# Altium project UU003_UUViewer.PrjPcb
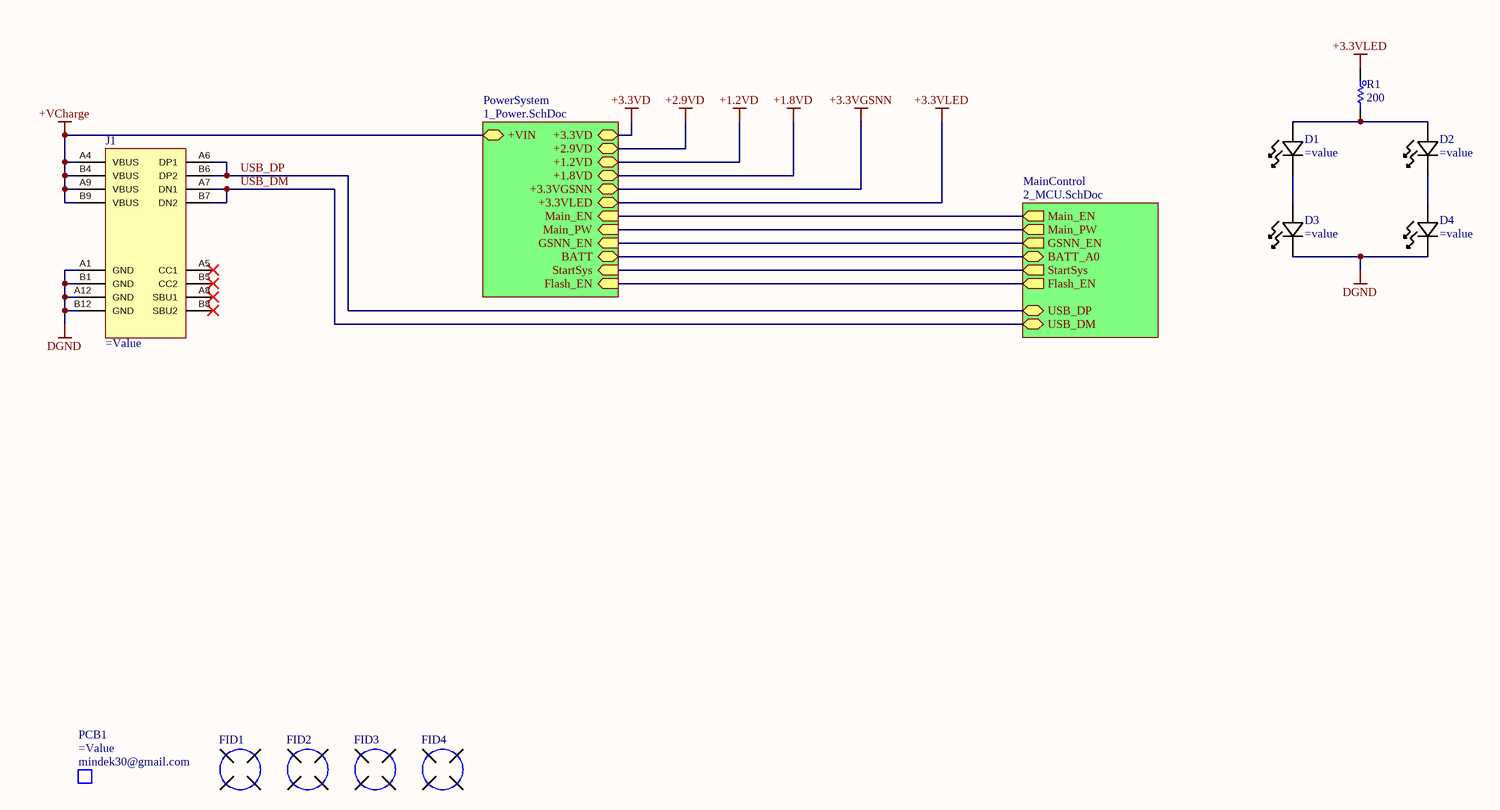
[diagram p0: 0_Overview.SchDoc]
PCB_Name: UU_MonitorMeter; PCB_PN: UM001; PCB_Rev: A; PCBA_PN: UM001; PCBA_Rev: A
3 sheets, 130 parts. Net scope: hierarchical (ports join the sheet entries above them; power ports are global).
Board file: UU001_UUViewer.PcbDoc
Sheets:
  0_Overview.SchDoc
    MainControl = 2_MCU.SchDoc
    PowerSystem = 1_Power.SchDoc

## Sheet 0_Overview.SchDoc: Overview
size A3; DocumentNumber: 1; SheetNumber: 1; SheetTotal: 6; PageSetup: Record=PageOptions|CenterHorizontal=True|CenterVertical=True|PrintScale=1.01|XCorrection=1.00|YCorrection=1.00|PrintKind=0|BorderSize=5000000|LeftOffset=0|BottomOffset=0|Orientation=2|PaperLength=1000|PaperWidth=1000|Scale=100|PaperSource=7|PrintQuality=-4|MediaType=1|DitherType=10|PaperKind=A3|PrintScaleMode=1

### Parts
D1  (no value)  [LED_0VS75000_WRE]
D2  (no value)  [LED_0VS75000_WRE]
D3  (no value)  [LED_0VS75000_WRE]
D4  (no value)  [LED_0VS75000_WRE]
FID1  FIDUCIAL  [FID]  (value not drawn)  (no BOM)
FID2  FIDUCIAL  [FID]  (value not drawn)  (no BOM)
FID3  FIDUCIAL  [FID]  (value not drawn)  (no BOM)
FID4  FIDUCIAL  [FID]  (value not drawn)  (no BOM)
J1  (no value)  [2137160001_MOL_2137160001(Primary)]
PCB1  Manufacturer: mindek30@gmail.com  (mechanical)
R1  200  [R_2512]

### Sub-sheets
MainControl = 2_MCU.SchDoc: BATT_A0 (bidir), GSNN_EN (out), USB_DP (bidir), USB_DM (bidir), Main_PW (out), Main_EN (out), StartSys (out), Flash_EN (out)
PowerSystem = 1_Power.SchDoc: +3.3VD (bidir), BATT (bidir), +VIN (bidir), +3.3VGSNN (bidir), +1.8VD (bidir), +2.9VD (bidir), GSNN_EN (in), +1.2VD (bidir), Main_PW (in), Main_EN (in), StartSys (in), Flash_EN (in), +3.3VLED (bidir)

### Nets
+3.3VLED: R1.1 ; sheet PowerSystem/+3.3VLED
+VCharge: J1.A4(VBUS) J1.A9(VBUS) J1.B4(VBUS) J1.B9(VBUS) ; sheet PowerSystem/+VIN
DGND: D3.2 D4.2 J1.A1(GND) J1.A12(GND) J1.B1(GND) J1.B12(GND)
LTE_GPSEN: sheet MainControl/GSNN_EN, sheet PowerSystem/GSNN_EN
Main_EN: sheet MainControl/Main_EN, sheet PowerSystem/Main_EN
Main_PW: sheet MainControl/Main_PW, sheet PowerSystem/Main_PW
RTC: sheet MainControl/StartSys, sheet PowerSystem/StartSys
USB_DM: J1.A7(DN1) J1.B7(DN2) ; sheet MainControl/USB_DM
USB_DP: J1.A6(DP1) J1.B6(DP2) ; sheet MainControl/USB_DP
NetD1_1: D1.1 D2.1 R1.2
NetD1_2: D1.2 D3.1
NetD2_2: D2.2 D4.1
NetR102_2: sheet MainControl/BATT_A0, sheet PowerSystem/BATT
NetR107_1: sheet MainControl/Flash_EN, sheet PowerSystem/Flash_EN

Not connected (* = marked no-connect by the designer): J1 A5(CC1)* A8(SBU1)* B5(CC2)* B8(SBU2)*

### Notes on the sheet
- Title :
- Revision :
- ผู้จัดทำ:
- Size:
- A3
- Time:
- ผู้เขียน:
- บริษัท ยูนิเวอร์แซล ยูทีลิตี้ส์ จำกัด (มหาชน) เลขที่ 1 อาคาร อีสท์วอเตอร์ ชั้น 18 ซอยวิภาวดีรังสิต 5 แขวงจอมพล เขตจตุจักร กรุงเทพฯ 10900
  Tel : +662-272-1688
  Fax :+662-2721690-1
- -
- Sheet:
- of
- ผู้อำนวยการ
- ผู้ตรวจสอบ:
- Number:
- กรรมการผู้จัดการ:
- File:

### Library data of the parts
D1-D4 = D_LED_150060BS75000: LED BLUE CLEAR 0603 SMD; Manufacturer: Wurth Electronics; Value: 150060VS75000; PackageReference: 0603; PartID: 732-4980-1-ND; PartNumber: 150060VS75000
FID1-FID4 = FID_FIDUCIAL: Manufacturer: mindek30@gmail.com; PartNumber: UM001_A; Value2: Non SE; Value: Non SE; PartID: A; PackageReference: Non SE; Value3: Non SE
J1 = CON_USBC: CONN RCPT USB2.0 TYPE C 24POS RA; PartNumber: 2137160001; Manufacturer: Molex; Value: 2137160001; PartID: 900-2137160001CT-ND; PackageReference: *; Value2: *; Value3: *
PCB1 = PCB_Bare: BARE PCB; PartNumber: UM001_A; PackageReference: Non SE; PartID: A; Value2: =JobFile_Title; Value: =PartNumber; Value3: UM001_A
R1 = R_Resister: Resistor; Manufacturer: Vishay; PartNumber: EXB-2HV472JV; Value: 200; PackageReference: 0603; PartID: *; Value2: *; Value3: *

## Sheet 2_MCU.SchDoc
size A3; DocumentNumber: 3; SheetNumber: 3; SheetTotal: 6; PageSetup: Record=PageOptions|CenterHorizontal=True|CenterVertical=True|PrintScale=1.01|XCorrection=1.00|YCorrection=1.00|PrintKind=0|BorderSize=5000000|LeftOffset=0|BottomOffset=0|Orientation=2|PaperLength=1000|PaperWidth=1000|Scale=100|PaperSource=7|PrintQuality=-4|MediaType=1|DitherType=10|PaperKind=A3|PrintScaleMode=1
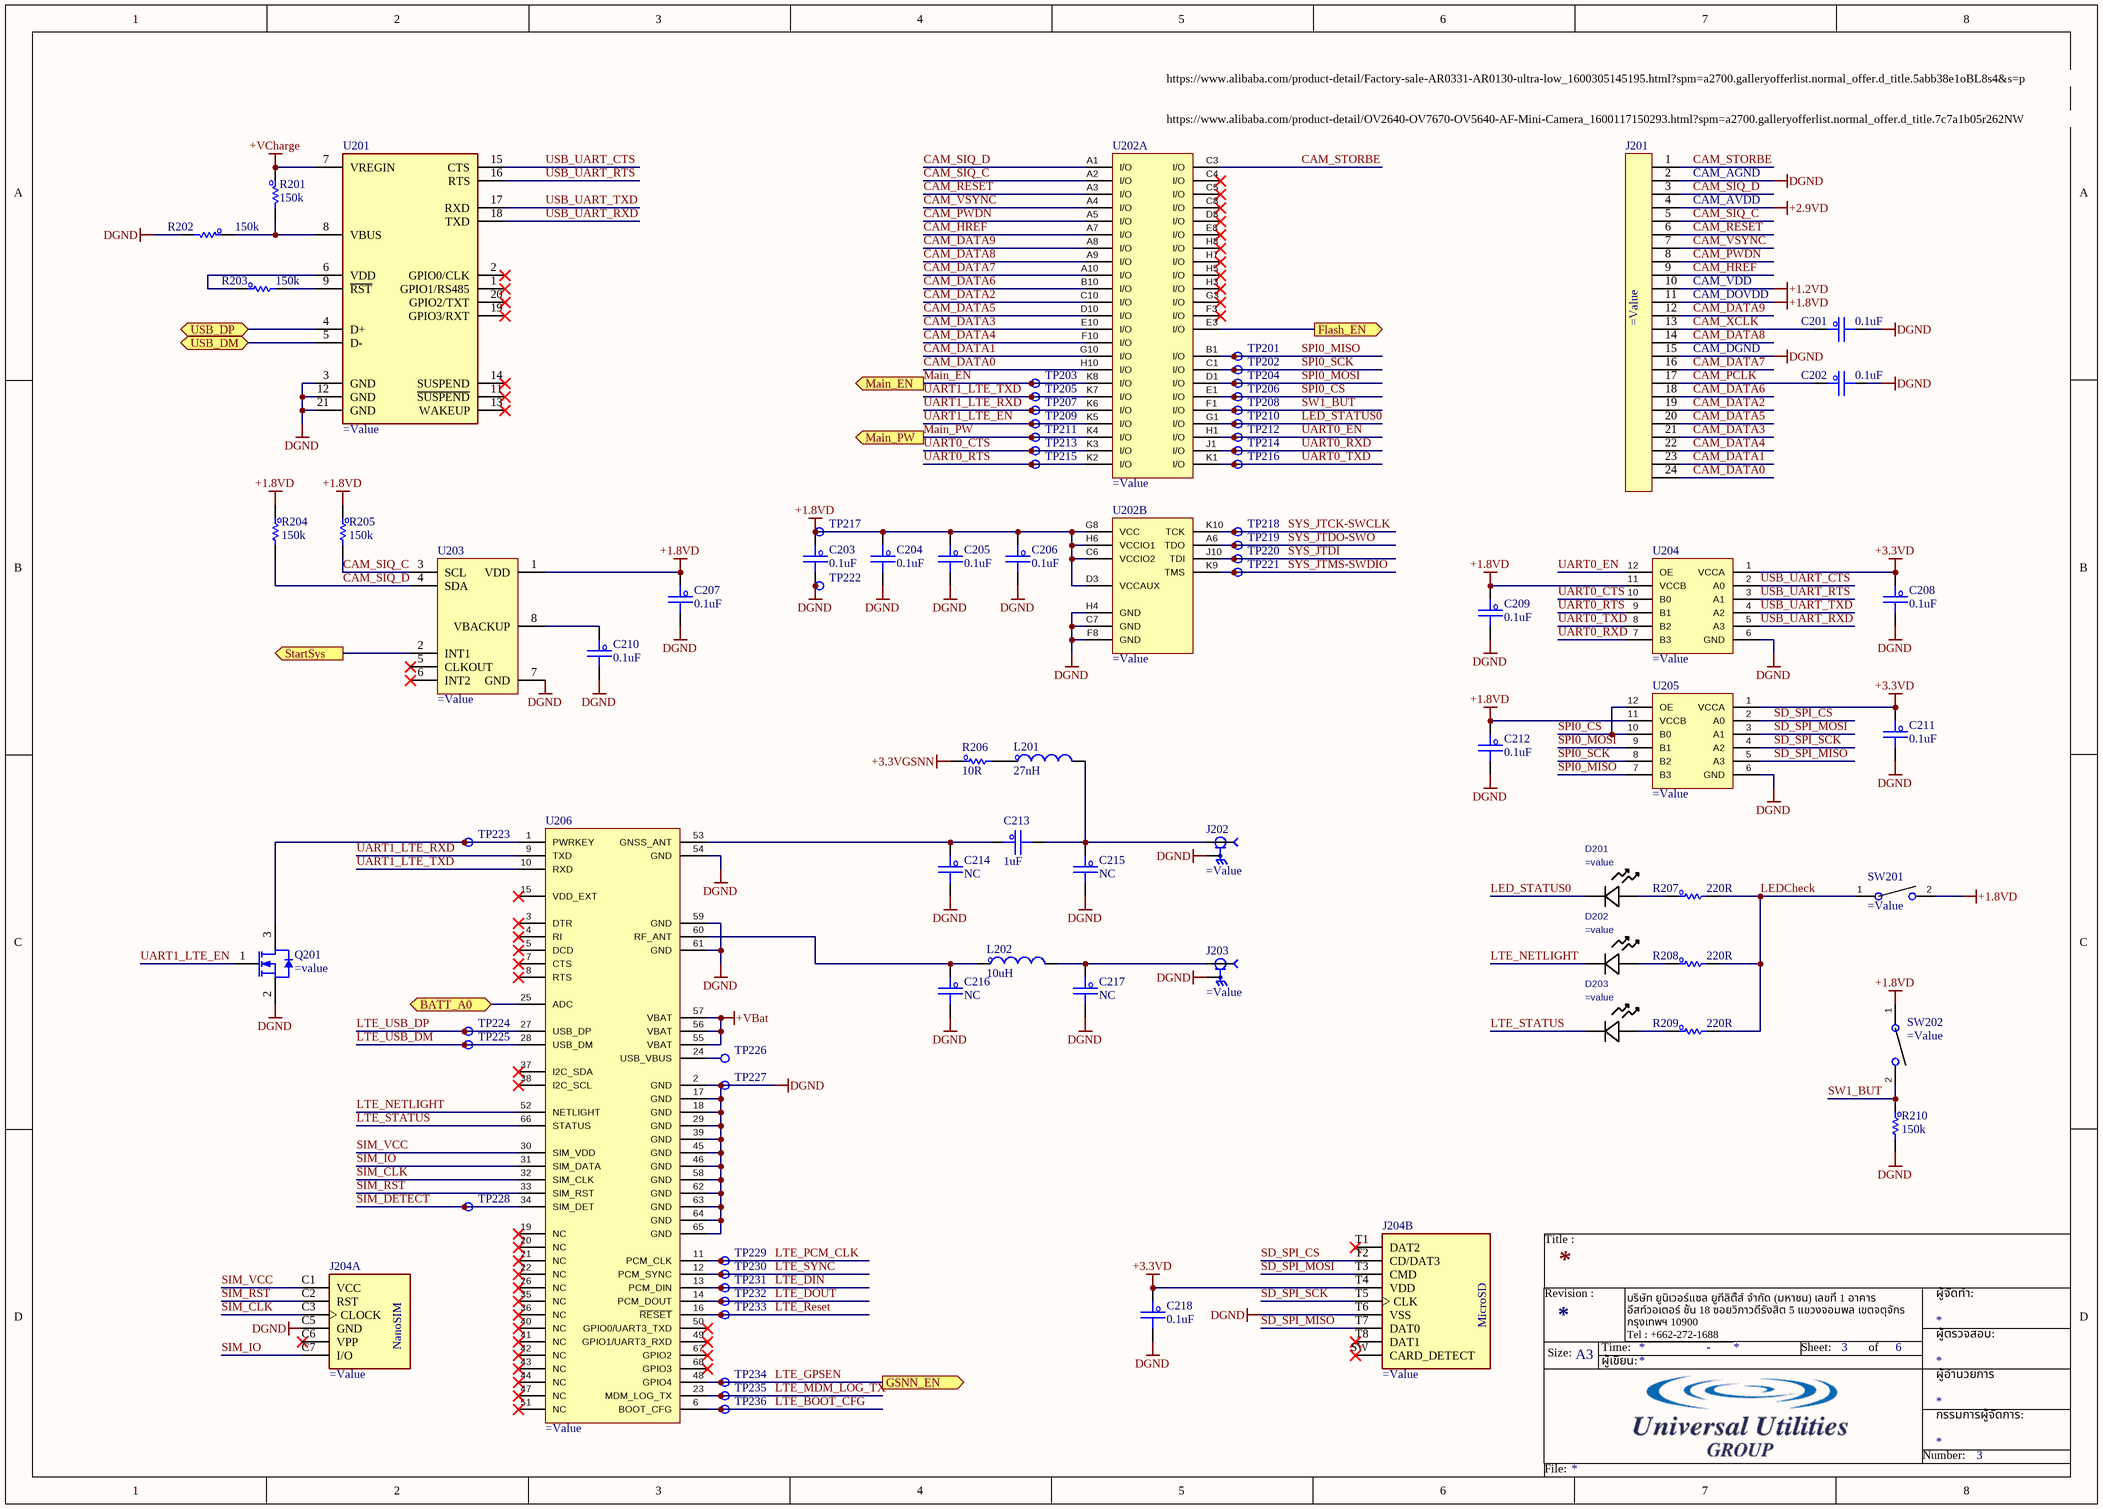
[diagram p1: 2_MCU.SchDoc]

### Parts
C201  0.1uF  [C_0603]
C202  0.1uF  [C_0603]
C203  0.1uF  [C_0603]
C204  0.1uF  [C_0603]
C205  0.1uF  [C_0603]
C206  0.1uF  [C_0603]
C207  0.1uF  [C_0603]
C208  0.1uF  [C_0603]
C209  0.1uF  [C_0603]
C210  0.1uF  [C_0603]
C211  0.1uF  [C_0603]
C212  0.1uF  [C_0603]
C213  1uF  [C_0603]
C214  NC  [C_0603]  (no BOM)
C215  NC  [C_0603]  (no BOM)
C216  NC  [C_0603]  (no BOM)
C217  NC  [C_0603]  (no BOM)
C218  0.1uF  [C_0603]
D201  (no value)  [LED_0VS75000_WRE]
D202  (no value)  [LED_0VS75000_WRE]
D203  (no value)  [LED_0VS75000_WRE]
J201  (no value)  [PANASONIC_AYF532435]
J202  (no value)  [MOLEX_0734120114]
J203  (no value)  [MOLEX_0734120114]
J204  (no value)  [MOLEX_1042391430]  (parts A,B of 2)
L201  27nH  [L_0603]
L202  10uH  [L_0603]
Q201  (no value)  [SOT95P245X110-3M]
R201  150k  [R_0603]
R202  150k  [R_0603]
R203  150k  [R_0603]
R204  150k  [R_0603]
R205  150k  [R_0603]
R206  10R  [R_0603]
R207  220R  [R_0603]
R208  220R  [R_0603]
R209  220R  [R_0603]
R210  150k  [R_0603]
SW201  (no value)  [SW_KSS241GLFS_CN]
SW202  (no value)  [SW_KSS241GLFS_CN]
TP201  (no value)  [TP_Testpoint]  (no BOM)
TP202  (no value)  [TP_Testpoint]  (no BOM)
TP203  (no value)  [TP_Testpoint]  (no BOM)
TP204  (no value)  [TP_Testpoint]  (no BOM)
TP205  (no value)  [TP_Testpoint]  (no BOM)
TP206  (no value)  [TP_Testpoint]  (no BOM)
TP207  (no value)  [TP_Testpoint]  (no BOM)
TP208  (no value)  [TP_Testpoint]  (no BOM)
TP209  (no value)  [TP_Testpoint]  (no BOM)
TP210  (no value)  [TP_Testpoint]  (no BOM)
TP211  (no value)  [TP_Testpoint]  (no BOM)
TP212  (no value)  [TP_Testpoint]  (no BOM)
TP213  (no value)  [TP_Testpoint]  (no BOM)
TP214  (no value)  [TP_Testpoint]  (no BOM)
TP215  (no value)  [TP_Testpoint]  (no BOM)
TP216  (no value)  [TP_Testpoint]  (no BOM)
TP217  (no value)  [TP_Testpoint]  (no BOM)
TP218  (no value)  [TP_Testpoint]  (no BOM)
TP219  (no value)  [TP_Testpoint]  (no BOM)
TP220  (no value)  [TP_Testpoint]  (no BOM)
TP221  (no value)  [TP_Testpoint]  (no BOM)
TP222  (no value)  [TP_Testpoint]  (no BOM)
TP223  (no value)  [TP_Testpoint]  (no BOM)
TP224  (no value)  [TP_Testpoint]  (no BOM)
TP225  (no value)  [TP_Testpoint]  (no BOM)
TP226  (no value)  [TP_Testpoint]  (no BOM)
TP227  (no value)  [TP_Testpoint]  (no BOM)
TP228  (no value)  [TP_Testpoint]  (no BOM)
TP229  (no value)  [TP_Testpoint]  (no BOM)
TP230  (no value)  [TP_Testpoint]  (no BOM)
TP231  (no value)  [TP_Testpoint]  (no BOM)
TP232  (no value)  [TP_Testpoint]  (no BOM)
TP233  (no value)  [TP_Testpoint]  (no BOM)
TP234  (no value)  [TP_Testpoint]  (no BOM)
TP235  (no value)  [TP_Testpoint]  (no BOM)
TP236  (no value)  [TP_Testpoint]  (no BOM)
U201  (no value)  [SILABS_CP2102N-A02-GQFN20R]
U202  (no value)  [CP56_XIL_XC2C64A-5CPG56C]  (parts A,B of 2)
U203  (no value)  [RV8523C3]
U204  (no value)  [UMLP12_1P7X2_O00]
U205  (no value)  [UMLP12_1P7X2_O00]
U206  (no value)  [SIM7000A S2-1000]

### Ports
BATT_A0 (bidir), Flash_EN (out), GSNN_EN (out), Main_EN (out), Main_PW (out), StartSys (out), USB_DM (bidir), USB_DP (bidir)

### Nets
+1.2VD: J201.10
+1.8VD: C203.1 C204.1 C205.1 C206.1 C207.1 C209.1 C212.1 J201.11 R204.1 R205.1 SW201.2 SW202.1 TP217.1 U202.C6(VCCIO2) U202.D3(VCCAUX) U202.G8(VCC) U202.H6(VCCIO1) U203.1(VDD) U204.11(VCCB) U205.11(VCCB)
+2.9VD: J201.4
+3.3VD: C208.1 C211.1 C218.1 J204.T4(VDD) U204.1(VCCA) U205.1(VCCA)
+3.3VGSNN: R206.1
+VBat: U206.55(VBAT) U206.56(VBAT) U206.57(VBAT)
+VCharge: R201.1 U201.7(VREGIN)
DGND: C201.2 C202.2 C203.2 C204.2 C205.2 C206.2 C207.2 C208.2 C209.2 C210.2 C211.2 C212.2 C214.2 C215.2 C216.2 C217.2 C218.2 J201.2 J201.15 J202.2 J203.2 J204.C5(GND) J204.T6(VSS) Q201.2(S) R202.2 R210.2 TP222.1 TP227.1 U201.3(GND) U201.12(GND) U201.21(GND) U202.C7(GND) U202.F8(GND) U202.H4(GND) U203.7(GND) U204.6(GND) U205.6(GND) U206.2(GND) U206.17(GND) U206.18(GND) U206.29(GND) U206.39(GND) U206.45(GND) U206.46(GND) U206.54(GND) U206.58(GND) U206.59(GND) U206.61(GND) U206.62(GND) U206.63(GND) U206.64(GND) U206.65(GND)
CAM_DATA0: J201.24 U202.H10(I/O)
CAM_DATA1: J201.23 U202.G10(I/O)
CAM_DATA2: J201.19 U202.C10(I/O)
CAM_DATA3: J201.21 U202.E10(I/O)
CAM_DATA4: J201.22 U202.F10(I/O)
CAM_DATA5: J201.20 U202.D10(I/O)
CAM_DATA6: J201.18 U202.B10(I/O)
CAM_DATA7: J201.16 U202.A10(I/O)
CAM_DATA8: J201.14 U202.A9(I/O)
CAM_DATA9: J201.12 U202.A8(I/O)
CAM_HREF: J201.9 U202.A7(I/O)
CAM_PCLK: C202.1 J201.17
CAM_PWDN: J201.8 U202.A5(I/O)
CAM_RESET: J201.6 U202.A3(I/O)
CAM_SIQ_C: J201.5 R205.2 U202.A2(I/O) U203.3(SCL)
CAM_SIQ_D: J201.3 R204.2 U202.A1(I/O) U203.4(SDA)
CAM_STORBE: J201.1 U202.C3(I/O)
CAM_VSYNC: J201.7 U202.A4(I/O)
CAM_XCLK: C201.1 J201.13
LED_STATUS0: D201.2 TP210.1 U202.G1(I/O)
LEDCheck: R207.2 R208.2 R209.2 SW201.1
LTE_BOOT_CFG: TP236.1 U206.6(BOOT_CFG)
LTE_DIN: TP231.1 U206.13(PCM_DIN)
LTE_DOUT: TP232.1 U206.14(PCM_DOUT)
LTE_GPSEN: TP234.1 U206.48(GPIO4) ; port GSNN_EN
LTE_MDM_LOG_TX: TP235.1 U206.23(MDM_LOG_TX)
LTE_NETLIGHT: D202.2 U206.52(NETLIGHT)
LTE_PCM_CLK: TP229.1 U206.11(PCM_CLK)
LTE_Reset: TP233.1 U206.16(~{RESET})
LTE_STATUS: D203.2 U206.66(STATUS)
LTE_SYNC: TP230.1 U206.12(PCM_SYNC)
LTE_USB_DM: TP225.1 U206.28(USB_DM)
LTE_USB_DP: TP224.1 U206.27(USB_DP)
Main_EN: TP203.1 U202.K8(I/O) ; port Main_EN
Main_PW: TP211.1 U202.K4(I/O) ; port Main_PW
RTC: U203.2(INT1) ; port StartSys
SD_SPI_CS: J204.T2(CD/DAT3) U205.2(A0)
SD_SPI_MISO: J204.T7(DAT0) U205.5(A3)
SD_SPI_MOSI: J204.T3(CMD) U205.3(A1)
SD_SPI_SCK: J204.T5(CLK) U205.4(A2)
SIM_CLK: J204.C3(CLOCK) U206.32(SIM_CLK)
SIM_DETECT: TP228.1 U206.34(SIM_DET)
SIM_IO: J204.C7(I/O) U206.31(SIM_DATA)
SIM_RST: J204.C2(RST) U206.33(SIM_RST)
SIM_VCC: J204.C1(VCC) U206.30(SIM_VDD)
SPI0_CS: TP206.1 U202.E1(I/O) U205.10(B0) U205.12(OE)
SPI0_MISO: TP201.1 U202.B1(I/O) U205.7(B3)
SPI0_MOSI: TP204.1 U202.D1(I/O) U205.9(B1)
SPI0_SCK: TP202.1 U202.C1(I/O) U205.8(B2)
SW1_BUT: R210.1 SW202.2 TP208.1 U202.F1(I/O)
SYS_JTCK-SWCLK: TP218.1 U202.K10(TCK)
SYS_JTDI: TP220.1 U202.J10(TDI)
SYS_JTDO-SWO: TP219.1 U202.A6(TDO)
SYS_JTMS-SWDIO: TP221.1 U202.K9(TMS)
UART0_CTS: TP213.1 U202.K3(I/O) U204.10(B0)
UART0_EN: TP212.1 U202.H1(I/O) U204.12(OE)
UART0_RTS: TP215.1 U202.K2(I/O) U204.9(B1)
UART0_RXD: TP214.1 U202.J1(I/O) U204.7(B3)
UART0_TXD: TP216.1 U202.K1(I/O) U204.8(B2)
UART1_LTE_EN: Q201.1(G) TP209.1 U202.K5(I/O)
UART1_LTE_RXD: TP207.1 U202.K6(I/O) U206.9(TXD)
UART1_LTE_TXD: TP205.1 U202.K7(I/O) U206.10(RXD)
USB_DM: U201.5(D-) ; port USB_DM
USB_DP: U201.4(D+) ; port USB_DP
USB_UART_CTS: U201.15(CTS) U204.2(A0)
USB_UART_RTS: U201.16(RTS) U204.3(A1)
USB_UART_RXD: U201.18(TXD) U204.5(A3)
USB_UART_TXD: U201.17(RXD) U204.4(A2)
NetC210_1: C210.1 U203.8(VBACKUP)
NetC213_1: C213.1 C214.1 U206.53(GNSS_ANT)
NetC213_2: C213.2 C215.1 J202.1 L201.2
NetC216_1: C216.1 L202.1 U206.60(RF_ANT)
NetC217_1: C217.1 J203.1 L202.2
NetD201_1: D201.1 R207.1
NetD202_1: D202.1 R208.1
NetD203_1: D203.1 R209.1
NetL201_1: L201.1 R206.2
NetQ201_3: Q201.3(D) TP223.1 U206.1(PWRKEY)
NetR102_2: U206.25(ADC) ; port BATT_A0
NetR107_1: U202.E3(I/O) ; port Flash_EN
NetR201_2: R201.2 R202.1 U201.8(VBUS)
NetR203_1: R203.1 U201.6(VDD)
NetR203_2: R203.2 U201.9(~{RST})
NetTP226_1: TP226.1 U206.24(USB_VBUS)

Not connected (* = marked no-connect by the designer): J204 C6(VPP)* SW(CARD_DETECT)* T1(DAT2)* T8(DAT1)*; U201 1(GPIO1/RS485)* 2(GPIO0/CLK)* 11(~{SUSPEND})* 13(WAKEUP)* 14(SUSPEND)* 19(GPIO3/RXT)* 20(GPIO2/TXT)*; U202 C4(I/O)* C5(I/O)* C8(I/O)* D8(I/O)* E8(I/O)* F3(I/O)* G3(I/O)* H3(I/O)* H5(I/O)* H7(I/O)* H8(I/O)*; U203 5(CLKOUT)* 6(INT2)*; U206 3(DTR)* 4(RI)* 5(DCD)* 7(CTS)* 8(RTS)* 15(VDD_EXT)* 19(NC)* 20(NC)* 21(NC)* 22(NC)* 26(NC)* 35(NC)* 36(NC)* 37(I2C_SDA)* 38(I2C_SCL)* 40(NC)* 41(NC)* 42(NC)* 43(NC)* 44(NC)* 47(NC)* 49(GPIO1/UART3_RXD)* 50(GPIO0/UART3_TXD)* 51(NC)* 67(GPIO2)* 68(GPIO3)*

### Notes on the sheet
- https://www.alibaba.com/product-detail/Factory-sale-AR0331-AR0130-ultra-low_1600305145195.html?spm=a2700.galleryofferlist.normal_offer.d_title.5abb38e1oBL8s4&s=p
- https://www.alibaba.com/product-detail/OV2640-OV7670-OV5640-AF-Mini-Camera_1600117150293.html?spm=a2700.galleryofferlist.normal_offer.d_title.7c7a1b05r262NW
- (near J201) CAM_AGND
- (near J201) CAM_AVDD
- (near J201) CAM_DOVDD
- (near J201) CAM_VDD
- (near J201) CAM_DGND
- Title :
- Revision :
- ผู้จัดทำ:
- Size:
- A3
- Time:
- ผู้เขียน:
- บริษัท ยูนิเวอร์แซล ยูทีลิตี้ส์ จำกัด (มหาชน) เลขที่ 1 อาคาร อีสท์วอเตอร์ ชั้น 18 ซอยวิภาวดีรังสิต 5 แขวงจอมพล เขตจตุจักร กรุงเทพฯ 10900
  Tel : +662-272-1688
  Fax :+662-2721690-1
- -
- Sheet:
- of
- ผู้อำนวยการ
- ผู้ตรวจสอบ:
- Number:
- กรรมการผู้จัดการ:
- File:
- (in symbol CON_SIMSD_1042391430, part A) NanoSIM
- (in symbol CON_SIMSD_1042391430, part B) MicroSD

### Library data of the parts
C201-C212 C218 = C_Capacitor: CAP CER 0.1UF 50V X7R 0603; Manufacturer: KEMET; PartNumber: C0603C104K5RACTU; PackageReference: 0603; PartID: 399-5089-1-ND; Value2: 50V; Value: 0.1uF; Value3: *
C213-C217 = C_Capacitor: Capacitor; Manufacturer: *; PackageReference: 0402; PartID: *; PartNumber: *; Value2: *; Value3: *
  C213: Value: 1uF
  C214-C217: Value: NC
D201-D203 = D_LED_150060BS75000: as D1 on sheet 0_Overview; PackageReference: 0603; PartID: 732-4980-1-ND; PartNumber: 150060VS75000
J201 = CON_24P: CONN FFC FPC 24POS 0.50MM R/A; PartNumber: AYF532435; Manufacturer: Panasonic Electric Works; Value: AYF532435; PartID: 255-3062-1-ND; PackageReference: *; Value2: *
J202 J203 = CON_U.FL: CONN UMC RCPT STR 50 OHM SMD; PartNumber: 0734120114; Manufacturer: Molex; Value: 0734120114; PartID: WM3894CT-ND; PackageReference: U.FL; Value3: *
J204 = CON_SIMSD_1042391430: IC CPLD 64MC 4.6NS 56BGA; PartNumber: XC2C64A-5CP56C; Manufacturer: AMD Xilinx; Value: XC2C64A-5CP56C; PartID: 217-XC2C64A-5CP56C; PackageReference: CSP-56; Value2: *; Value3: *
L201 L202 = L_Inductor: 10µH Shielded Multilayer Inductor 250mA 1.05Ohm 0603 (1608 Metric); Manufacturer: TDK Corporation; PartNumber: MLZ1608M100WT000; PackageReference: 0603; PartID: 445-6389-1-ND; Value3: *
  L201: Value: 27nH
  L202: Value: 10uH
Q201 = Q_NMOS_2N7002H: MOSFET N-CH 60V 300MA SOT23-3; Manufacturer: Infineon Technologies; Value: 2N7002H6327XTSA2; PackageReference: SOT23; PartID: 2N7002H6327XTSA2CT-ND; PartNumber: 2N7002H6327XTSA2; Value3: *
R201-R205 R210 = R_Resister: RES SMD 150K OHM 1% 1/10W 0603; Manufacturer: Vishay Dale; PartNumber: CRCW0603150KFKEAC; Value2: 0.1W; Value: 150k; PackageReference: 0603; PartID: 541-4034-1-ND; Value3: *
R206 = R_Resister: as R1 on sheet 0_Overview; Value: 10R; PackageReference: 0603; PartID: *; Value2: *; Value3: *
R207-R209 = R_Resister: RES SMD 220 OHM 1% 1/10W 0603; Manufacturer: Vishay Dale; PartNumber: CRCW0603220RFKEAC; Value2: 0.1W; Value: 220R; PackageReference: 0603; PartID: 541-4047-1-ND; Value3: *
SW201 SW202 = SW_TAC: SWITCH TACTILE SPST-NO 0.05A 50V; PartNumber: KSS241GLFS; Manufacturer: C&K; Value: KSS241GLFS; PartID: 401-1099-1-ND; PackageReference: *; Value2: *; Value3: *
TP201-TP236 = TP_TestPoint: TestPoint; Manufacturer: *; PackageReference: *; PartID: *; PartNumber: *; Value2: *; Value3: *
U201 = IC_USB_CP2102N: IC USB TO UART BRIDGE QFN20; PartNumber: CP2102N-A02-GQFN20; Manufacturer: Silicon Labs; Value: CP2102N-A02-GQFN20; PartID: 634-CP2102NA02GQFN20; PackageReference: QFN-20; Value2: *; Value3: *
U202 = IC_FPGA_XC2C64A: IC CPLD 64MC 4.6NS 56BGA; PartNumber: XC2C64A-5CP56C; Manufacturer: AMD Xilinx; Value: XC2C64A-5CP56C; PartID: 217-XC2C64A-5CP56C; PackageReference: CSP-56; Value2: *; Value3: *
U203 = IC_RTC_RV-8523-C3: IC RTC CLK/CALENDAR I2C 10SON; PartNumber: RV-8523-C3-32.768KHZ-20PPM-TA-QC; Manufacturer: Micro Crystal AG; Value: RV-8523-C3-32.768KHZ-20PPM-TA-QC; PartID: 2195-RV-8523-C3-32.768KHZ-20PPM-TA-QCCT-ND; PackageReference: *; Value3: *
U204 U205 = IC_TRAN_FXLA0104X: IC TRNSLTR BIDIRECTIONAL 12MLP; PartNumber: FXLA0104QFX-F106; Manufacturer: onsemi; Value: FXLA0104QFX-F106; PartID: FXLA0104QFX-F106CT-ND; PackageReference: MLP-12; Value2: *; Value3: *
U206 = IC_MOD_SIM7000X: DGTL ISO 5000VRMS 6CH 16SOIC; Manufacturer: SIMCom Wireless Solutions Limited; Value: SIM7000G; Value3: 680 bth; PackageReference: QFN-68; PartNumber: SIM7000G

## Sheet 1_Power.SchDoc
size A3; DocumentNumber: 2; SheetNumber: 2; SheetTotal: 6
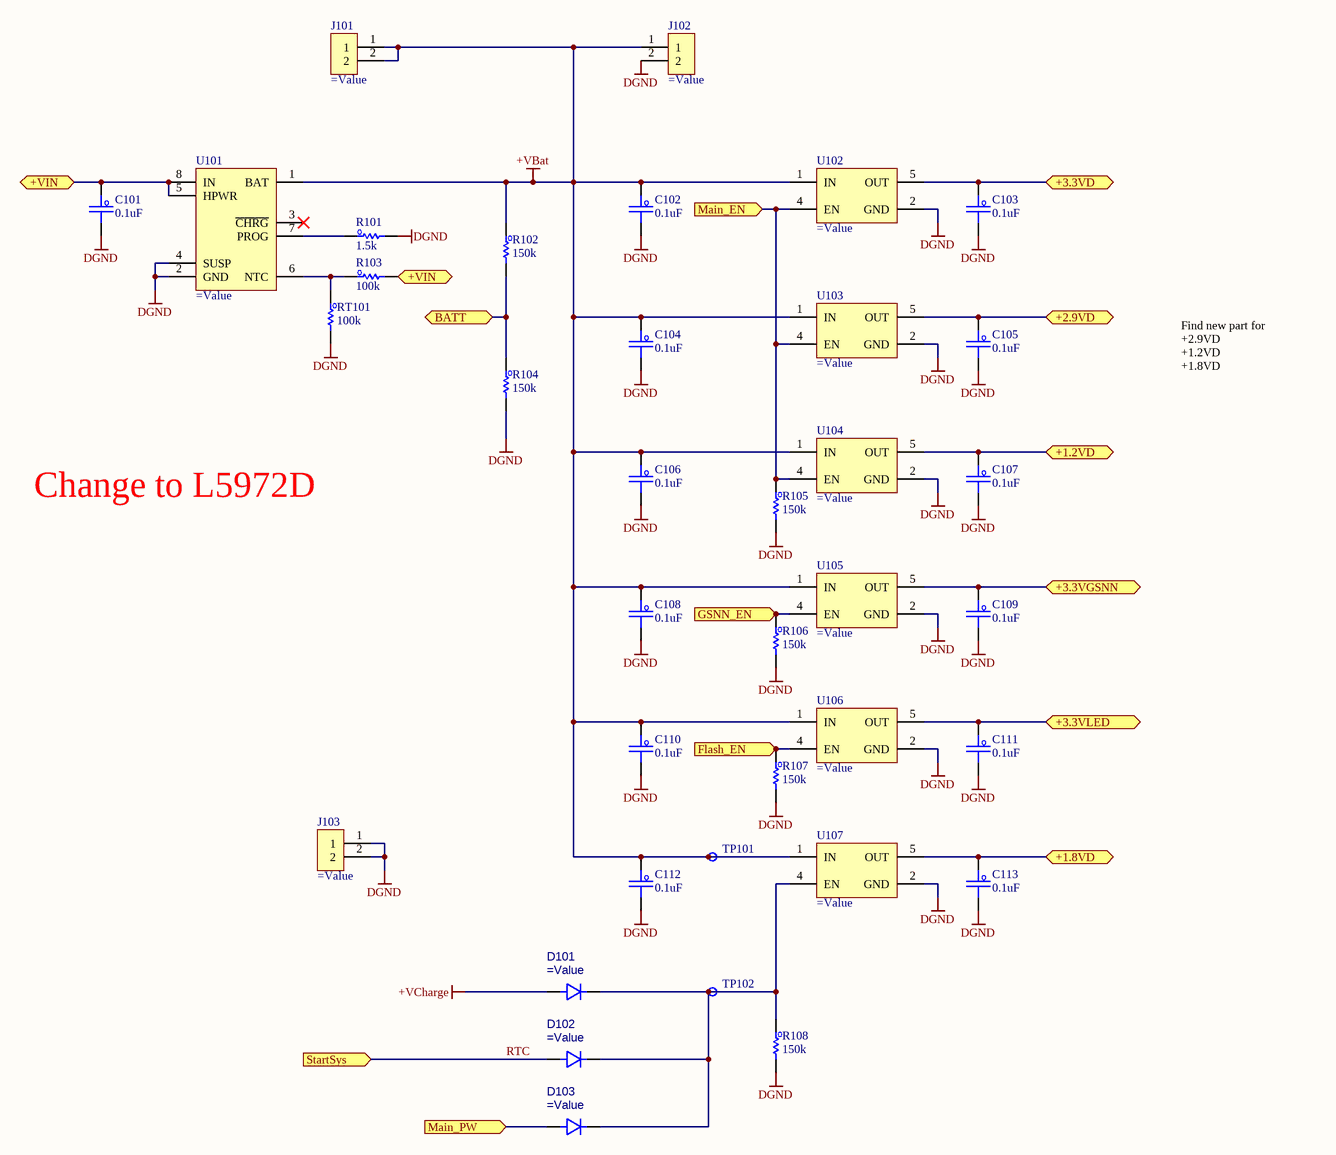
[diagram p2: 1_Power.SchDoc]

### Parts
C101  0.1uF  [C_0603]
C102  0.1uF  [C_0603]
C103  0.1uF  [C_0603]
C104  0.1uF  [C_0603]
C105  0.1uF  [C_0603]
C106  0.1uF  [C_0603]
C107  0.1uF  [C_0603]
C108  0.1uF  [C_0603]
C109  0.1uF  [C_0603]
C110  0.1uF  [C_0603]
C111  0.1uF  [C_0603]
C112  0.1uF  [C_0603]
C113  0.1uF  [C_0603]
D101  (no value)  [DFN119P160X30-2M]
D102  (no value)  [DFN119P160X30-2M]
D103  (no value)  [DFN119P160X30-2M]
J101  (no value)  [Keystone_254]
J102  (no value)  [CON_2P_Header]
J103  (no value)  [Keystone_254]
R101  1.5k  [R_0603]
R102  150k  [R_0603]
R103  100k  [R_0603]
R104  150k  [R_0603]
R105  150k  [R_0603]
R106  150k  [R_0603]
R107  150k  [R_0603]
R108  150k  [R_0603]
RT101  100k  [R_0603]
TP101  (no value)  [TP_Testpoint]  (no BOM)
TP102  (no value)  [TP_Testpoint]  (no BOM)
U101  (no value)  [SON45P200X200X80-9N]  (no BOM)
U102  (no value)  [SOT95P280X145-5N]
U103  (no value)  [SOT95P280X145-5N]
U104  (no value)  [SOT95P280X145-5N]
U105  (no value)  [SOT95P280X145-5N]
U106  (no value)  [SOT95P280X145-5N]
U107  (no value)  [SOT95P280X145-5N]

### Ports
+1.2VD (bidir), +1.8VD (bidir), +2.9VD (bidir), +3.3VD (bidir), +3.3VGSNN (bidir), +3.3VLED (bidir), +VIN (bidir), BATT (bidir), Flash_EN (in), GSNN_EN (in), Main_EN (in), Main_PW (in), StartSys (in)

### Nets
+1.2VD: C107.1 U104.5(OUT) ; port +1.2VD
+1.8VD: C113.1 U107.5(OUT) ; port +1.8VD
+2.9VD: C105.1 U103.5(OUT) ; port +2.9VD
+3.3VD: C103.1 U102.5(OUT) ; port +3.3VD
+3.3VGSNN: C109.1 U105.5(OUT) ; port +3.3VGSNN
+3.3VLED: C111.1 U106.5(OUT) ; port +3.3VLED
+VBat: C102.1 C104.1 C106.1 C108.1 C110.1 C112.1 J101.1 J101.2 J102.1 R102.1 TP101.1 U101.1(BAT) U102.1(IN) U103.1(IN) U104.1(IN) U105.1(IN) U106.1(IN) U107.1(IN)
+VCharge: C101.1 D101.2 R103.2 U101.5(HPWR) U101.8(IN) ; port +VIN
DGND: C101.2 C102.2 C103.2 C104.2 C105.2 C106.2 C107.2 C108.2 C109.2 C110.2 C111.2 C112.2 C113.2 J102.2 J103.1 J103.2 R101.2 R104.2 R105.2 R106.2 R107.2 R108.2 RT101.2 U101.2(GND) U101.4(SUSP) U102.2(GND) U103.2(GND) U104.2(GND) U105.2(GND) U106.2(GND) U107.2(GND)
LTE_GPSEN: R106.1 U105.4(EN) ; port GSNN_EN
Main_EN: R105.1 U102.4(EN) U103.4(EN) U104.4(EN) ; port Main_EN
Main_PW: D103.2 ; port Main_PW
RTC: D102.2 ; port StartSys
NetD101_1: D101.1 D102.1 D103.1 R108.1 TP102.1 U107.4(EN)
NetR101_1: R101.1 U101.7(PROG)
NetR102_2: R102.2 R104.1 ; port BATT
NetR103_1: R103.1 RT101.1 U101.6(NTC)
NetR107_1: R107.1 U106.4(EN) ; port Flash_EN

Not connected (* = marked no-connect by the designer): U101 3(~{CHRG})*

### Notes on the sheet
- Find new part for
  +2.9VD
  +1.2VD
  +1.8VD
- Change to L5972D
- Title :
- Revision :
- ผู้จัดทำ:
- Size:
- A3
- Time:
- ผู้เขียน:
- บริษัท ยูนิเวอร์แซล ยูทีลิตี้ส์ จำกัด (มหาชน) เลขที่ 1 อาคาร อีสท์วอเตอร์ ชั้น 18 ซอยวิภาวดีรังสิต 5 แขวงจอมพล เขตจตุจักร กรุงเทพฯ 10900
  Tel : +662-272-1688
  Fax :+662-2721690-1
- -
- Sheet:
- of
- ผู้อำนวยการ
- ผู้ตรวจสอบ:
- Number:
- กรรมการผู้จัดการ:
- File:

### Library data of the parts
C101-C113 = C_Capacitor: as C201 on sheet 2_MCU; PackageReference: 0603; PartID: 399-5089-1-ND; Value2: 50V; Value: 0.1uF; Value3: *
D101-D103 = D_PW_VSKY20301608: DIODE SCHOTTKY 30V 2A 0603; Manufacturer: Vishay General Semiconductor - Diodes Division; Value: VSKY20301608-G4-08; PackageReference: 0603; PartID: 112-VSKY20301608-G4-08CT-ND; PartNumber: VSKY20301608-G4-08
J101 J103 = CON_BAT_254: BATT CONTACT CLIP 18650 1CEL SMD; PartNumber: 254; Manufacturer: Keystone Electronics; Value: 254; PartID: 36-254-ND; PackageReference: *; Value3: *
J102 = CON_2P_Heder: Connector 2 position; PartNumber: 796866-2; Manufacturer: TE Connectivity AMP Connectors; Value: 796866-2; PartID: A98302-ND; PackageReference: TERM BLOCK; Value3: *
R101 = R_Resister: RES 1.5K OHM 5% 1/10W 0603; Manufacturer: Vishay Dale; PartNumber: CRCW06031K50JNEAC; Value2: 0.1W; Value: 1.5k; PackageReference: 0603; PartID: 541-CRCW06031K50JNEACCT-ND; Value3: *
R102 R104-R108 = R_Resister: as R201 on sheet 2_MCU; Value: 150k; PackageReference: 0603; PartID: 541-4034-1-ND; Value3: *
R103 RT101 = R_Resister: RES 1.5K OHM 5% 1/10W 0603; Manufacturer: Vishay Dale; Value: 100k; PackageReference: 0603; Value3: *
TP101 TP102 = TP_TestPoint: TestPoint; Manufacturer: *; PackageReference: *; PartID: *; PartNumber: *; Value2: *; Value3: *
U101 = IC_PMS_LTC4095: IC BATT CHG LI-ION 1CELL 8DFN; PartNumber: LTC4095EDC#TRMPBF; Manufacturer: Analog Devices Inc.; Value: LTC4095EDC#TRMPBF; PartID: LTC4095EDC#TRMPBFCT-ND; PackageReference: DFN-8; Value2: *; Value3: *
U102-U107 = IC_LDO_RT9069-33GB: 200mA 360mV@(10mA) Fixed 3.3V~3.3V Positive 1 36V SOT-23-5 Linear Voltage Regulators (LDO) ROHS; Manufacturer: Richtek Tech; PartNumber: RT9069-33GB; PartID: C147969; PackageReference: SOT-23-5; Value: RT9069-33GB; Value2: *; Value3: *

## Nets that join several sheets
+1.2VD: 2_MCU (J201.10), 1_Power (C107.1 U104.5)
+1.8VD: 2_MCU (20 pins), 1_Power (C113.1 U107.5)
+2.9VD: 2_MCU (J201.4), 1_Power (C105.1 U103.5)
+3.3VD: 2_MCU (6 pins), 1_Power (C103.1 U102.5)
+3.3VGSNN: 2_MCU (R206.1), 1_Power (C109.1 U105.5)
+3.3VLED: 0_Overview (R1.1), 1_Power (C111.1 U106.5)
+VBat: 2_MCU (U206.55 U206.56 U206.57), 1_Power (18 pins)
+VCharge: 0_Overview (J1.A4 J1.A9 J1.B4 J1.B9), 2_MCU (R201.1 U201.7), 1_Power (5 pins)
DGND: 0_Overview (6 pins), 2_MCU (52 pins), 1_Power (31 pins)
LTE_GPSEN: 2_MCU (TP234.1 U206.48), 1_Power (R106.1 U105.4)
Main_EN: 2_MCU (TP203.1 U202.K8), 1_Power (R105.1 U102.4 U103.4 U104.4)
Main_PW: 2_MCU (TP211.1 U202.K4), 1_Power (D103.2)
NetR102_2: 2_MCU (U206.25), 1_Power (R102.2 R104.1)
NetR107_1: 2_MCU (U202.E3), 1_Power (R107.1 U106.4)
RTC: 2_MCU (U203.2), 1_Power (D102.2)
USB_DM: 0_Overview (J1.A7 J1.B7), 2_MCU (U201.5)
USB_DP: 0_Overview (J1.A6 J1.B6), 2_MCU (U201.4)